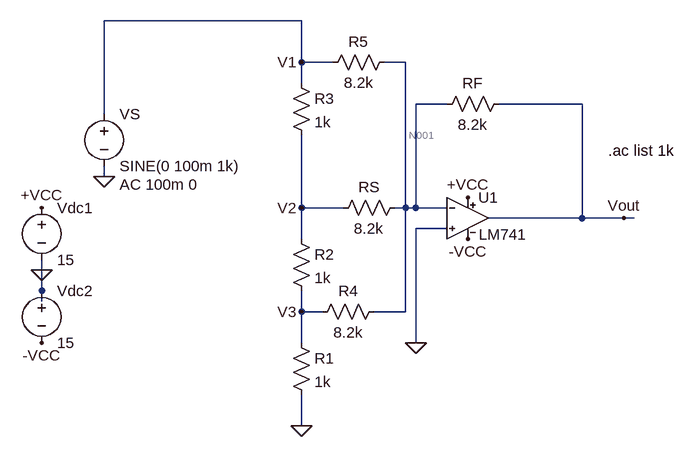
[diagram p0: schematic Adder.asc]
Adder.asc, the LTspice schematic file:
Version 4
SHEET 1 880 680
WIRE -16 -192 -320 -192
WIRE -16 -128 -16 -192
WIRE 32 -128 -16 -128
WIRE 144 -128 112 -128
WIRE -16 -96 -16 -128
WIRE 208 -64 160 -64
WIRE 416 -64 288 -64
WIRE -320 -48 -320 -192
WIRE -320 48 -320 32
WIRE -16 96 -16 -16
WIRE 48 96 -16 96
WIRE 144 96 144 -128
WIRE 144 96 128 96
WIRE 160 96 160 -64
WIRE 160 96 144 96
WIRE 208 96 160 96
WIRE 416 112 416 -64
WIRE 416 112 272 112
WIRE 480 112 416 112
WIRE 496 112 480 112
WIRE 208 128 160 128
WIRE -16 144 -16 96
WIRE -416 192 -416 176
WIRE -416 224 -416 192
WIRE -416 240 -416 224
WIRE -16 256 -16 224
WIRE 16 256 -16 256
WIRE 144 256 144 96
WIRE 144 256 96 256
WIRE -16 304 -16 256
WIRE 160 304 160 128
WIRE -16 432 -16 384
FLAG -416 96 +VCC
FLAG 240 80 +VCC
FLAG 480 112 Vout
FLAG -320 48 0
FLAG -416 304 -VCC
FLAG 240 144 -VCC
FLAG -416 192 0
FLAG 160 304 0
FLAG -16 432 0
FLAG -16 -128 V1
FLAG -16 96 V2
FLAG -16 256 V3
SYMBOL LM741 240 48 R0
SYMATTR InstName U1
SYMBOL voltage -416 80 R0
WINDOW 123 0 0 Left 0
WINDOW 39 0 0 Left 0
SYMATTR InstName Vdc1
SYMATTR Value 15
SYMBOL voltage -416 208 R0
WINDOW 123 0 0 Left 0
WINDOW 39 0 0 Left 0
SYMATTR InstName Vdc2
SYMATTR Value 15
SYMBOL voltage -320 -64 R0
WINDOW 123 24 124 Left 2
WINDOW 39 0 0 Left 0
SYMATTR Value2 AC 100m 0
SYMATTR InstName VS
SYMATTR Value SINE(0 100m 1k)
SYMBOL res 144 80 R90
WINDOW 0 0 56 VBottom 2
WINDOW 3 32 56 VTop 2
SYMATTR InstName RS
SYMATTR Value 8.2k
SYMBOL res 304 -80 R90
WINDOW 0 0 56 VBottom 2
WINDOW 3 32 56 VTop 2
SYMATTR InstName RF
SYMATTR Value 8.2k
SYMBOL res -32 -112 R0
WINDOW 0 36 40 Left 2
WINDOW 3 36 76 Left 2
SYMATTR InstName R3
SYMATTR Value 1k
SYMBOL res -32 128 R0
WINDOW 0 36 40 Left 2
WINDOW 3 36 76 Left 2
SYMATTR InstName R2
SYMATTR Value 1k
SYMBOL res -32 288 R0
WINDOW 0 36 40 Left 2
WINDOW 3 36 76 Left 2
SYMATTR InstName R1
SYMATTR Value 1k
SYMBOL res 112 240 R90
WINDOW 0 0 56 VBottom 2
WINDOW 3 32 56 VTop 2
SYMATTR InstName R4
SYMATTR Value 8.2k
SYMBOL res 128 -144 R90
WINDOW 0 0 56 VBottom 2
WINDOW 3 32 56 VTop 2
SYMATTR InstName R5
SYMATTR Value 8.2k
TEXT 456 8 Left 2 !.ac list 1k

The netlist it stands for:
* Adder.asc
XU1 0 N001 +VCC -VCC Vout LM741  ; pins In+ In- V+ V- OUT
Vdc1 +VCC 0 15
Vdc2 0 -VCC 15
VS V1 0 SINE(0 100m 1k) AC 100m 0
RS N001 V2 8.2k
RF Vout N001 8.2k
R3 V1 V2 1k
R2 V2 V3 1k
R1 V3 0 1k
R4 N001 V3 8.2k
R5 N001 V1 8.2k
.ac list 1k
.lib LM741.lib
.backanno
.end

* Results of the author's LTspice run, read from the files saved beside the schematic
* Operating Point, zero values left out:
*   V(n001) = 1 mV
*   V(-vcc) = -15 V
*   V(+vcc) = 15 V
*   V(vout) = 4.618 mV
*   V(v2) = 108.7 µV
*   V(v3) = 108.7 µV
*   I(R5) = 122 nA
*   I(R4) = 108.7 nA
*   I(R1) = 108.7 nA
*   I(R3) = -108.7 nA
*   I(Rf) = 441.2 nA
*   I(Rs) = 108.7 nA
*   I(Vs) = 230.6 nA
*   I(Vdc2) = -1.701 mA
*   I(Vdc1) = -1.701 mA
*   Ix(u1:1) = 57.86 nA
*   Ix(u1:2) = 101.9 nA
*   Ix(u1:99) = 1.701 mA
*   Ix(u1:50) = -1.701 mA
*   Ix(u1:28) = -441.2 nA
* AC Analysis:
*   frequency = 1 k
*   V(n001) = 1.622 µV
*   V(-vcc) = 0 V
*   V(+vcc) = 0 V
*   V(vout) = -189.1 mV
*   V(v1) = 100 mV
*   V(v2) = 60.58 mV
*   V(v3) = 28.55 mV
*   I(R5) = -12.19 µA
*   I(R4) = -3.481 µA
*   I(R1) = 28.55 µA
*   I(R2) = 32.03 µA
*   I(R3) = 39.42 µA
*   I(Rf) = -23.06 µA
*   I(Rs) = -7.388 µA
*   I(Vs) = -51.61 µA
*   I(Vdc2) = -11.5 µA
*   I(Vdc1) = 11.56 µA
*   Ix(u1:1) = -5.765 pA
*   Ix(u1:2) = 5.765 pA
*   Ix(u1:99) = -11.56 µA
*   Ix(u1:50) = -11.5 µA
*   Ix(u1:28) = 23.06 µA